# EAGLE design BeagleBone-MSP430Cape (EAGLE 6.4)
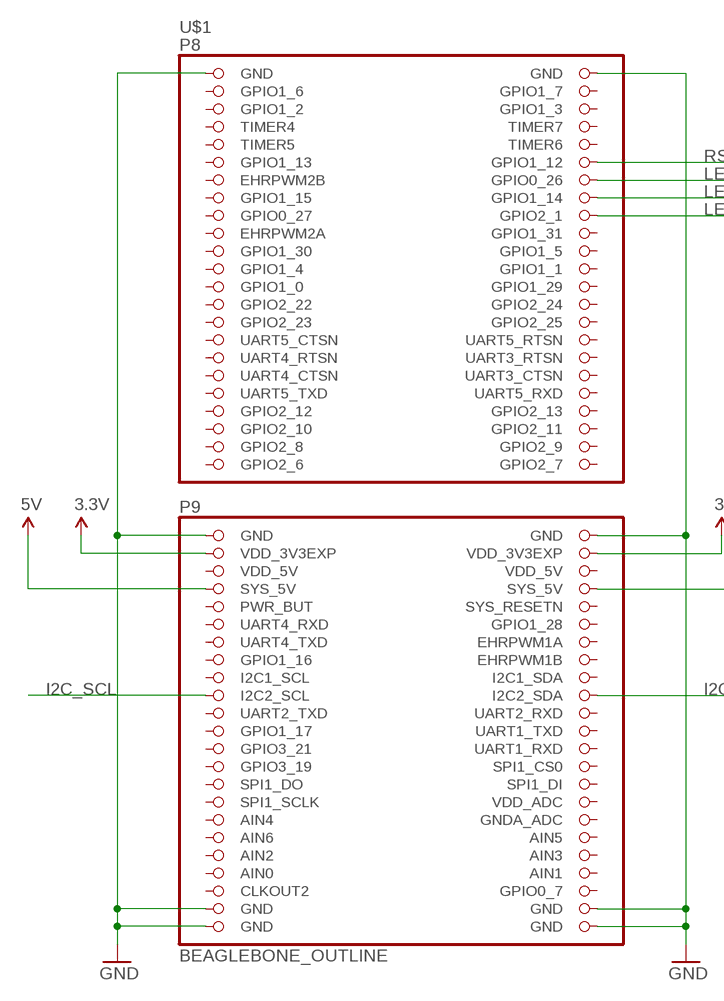
[diagram p0: schematic, sheet 1, part 1 of 2]
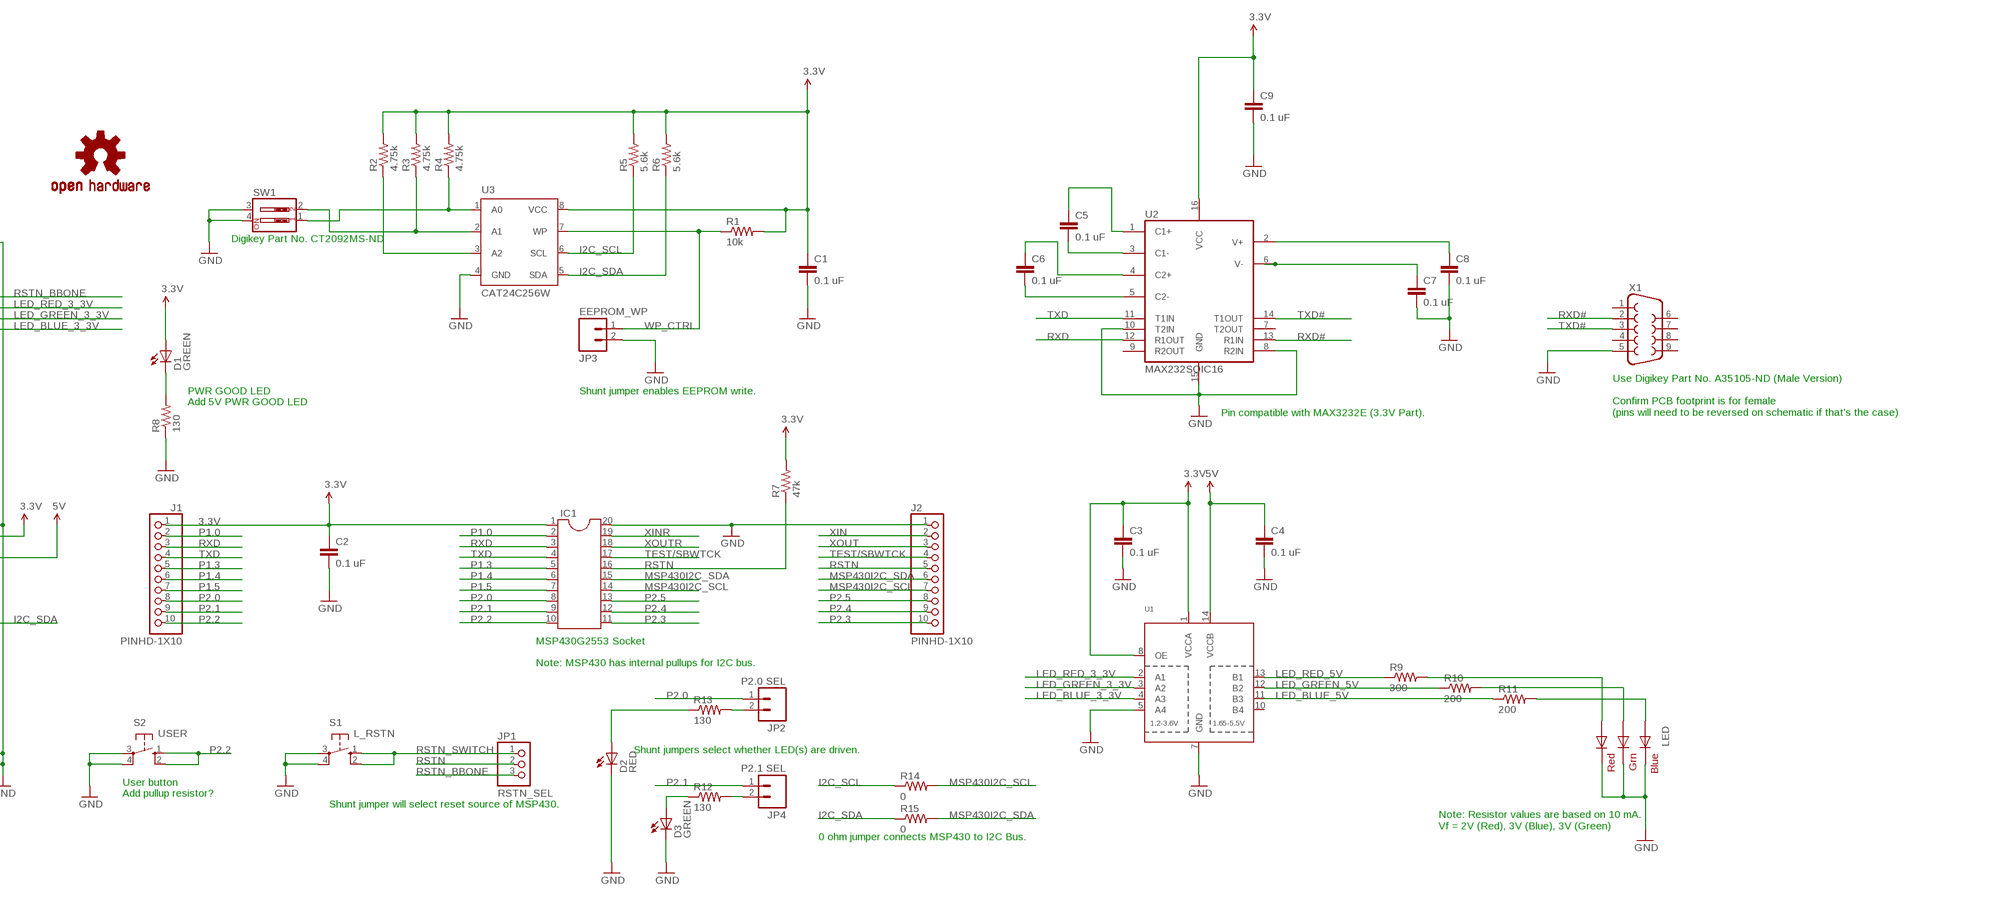
[diagram p1: schematic, sheet 1, part 2 of 2]

## Parts
C1  0.1 uF  CAP0805  [0805]
C2  0.1 uF  CAP0805  [0805]
C3  0.1 uF  CAP0805  [0805]
C4  0.1 uF  CAP0805  [0805]
C5  0.1 uF  CAP0805  [0805]
C6  0.1 uF  CAP0805  [0805]
C7  0.1 uF  CAP0805  [0805]
C8  0.1 uF  CAP0805  [0805]
C9  0.1 uF  CAP0805  [0805]
D1  GREEN  LED-GREEN0603  [LED-0603]
D2  RED  LED0603  [LED-0603]
D3  GREEN  LED0603  [LED-0603]
IC1  DIL20S  [SOCKET-20]
J1  PINHD-1X10  [1X10-BIG]
J2  PINHD-1X10  [1X10-BIG]
JP1  RSTN_SEL  PINHD-1X3  [1X03]
JP2  P2.0 SEL  M02PTH  [1X02]
JP3  EEPROM_WP  M02PTH  [1X02]
JP4  P2.1 SEL  M02PTH  [1X02]
LED  RGBLED5050  [RGBLED5050]
LOGO1  OSHW-LOGOL  [OSHW-LOGO-L]
R1  10k  RESISTOR0805-RES  [0805]
R2  4.75k  RESISTOR0805-RES  [0805]
R3  4.75k  RESISTOR0805-RES  [0805]
R4  4.75k  RESISTOR0805-RES  [0805]
R5  5.6k  RESISTOR0805-RES  [0805]
R6  5.6k  RESISTOR0805-RES  [0805]
R7  47k  RESISTOR0805-RES  [0805]
R8  130  RESISTOR0805-RES  [0805]
R9  300  RESISTOR0805-RES  [0805]
R10  200  RESISTOR0805-RES  [0805]
R11  200  RESISTOR0805-RES  [0805]
R12  130  RESISTOR0805-RES  [0805]
R13  130  RESISTOR0805-RES  [0805]
R14  0  RESISTOR0805-RES  [0805]
R15  0  RESISTOR0805-RES  [0805]
S1  L_RSTN  10-XX  [B3F-10XX]
S2  USER  10-XX  [B3F-10XX]
SW1  SW_DIP-2  [DIPSWITCH-02]
U1  TXB0104PWRSOIC14  [SO14]
U2  MAX232SOIC16  [SO016]
U3  CAT24C256W  [SO08]
U$1  BEAGLEBONE_OUTLINE  [BEAGLEBONE_SHIELD]
X1  DB9MALE  [DB9_MALE]

## Nets
3.3V: C1.1 C2.1 C3.1 C9.1 D1.A IC1.1 J1.1 R1.2 R2.2 R3.2 R4.2 R5.2 R6.2 R7.2 U1.1(VCCA) U1.8(OE) U2.16(VCC) U3.8(VCC) U$1.49(VDD_3V3EXP) U$1.50(VDD_3V3EXP)
5V: C4.1 U1.14(VCCB) U$1.53(SYS_5V) U$1.54(SYS_5V)
GND: C1.2 C2.2 C3.2 C4.2 C7.2 C8.2 C9.2 D2.C D3.C IC1.20 J2.1 JP3.2 LED.4(BLUE_C) LED.5(RED_C) LED.6(GREEN_C) R8.1 S1.3(P) S1.4(P1) S2.3(P) S2.4(P1) SW1.3 SW1.4 U1.5(A4) U1.7(GND) U2.8(R2IN) U2.10(T2IN) U2.15(GND) U3.4(GND) U$1.1(GND) U$1.2(GND) U$1.47(GND) U$1.48(GND) U$1.89(GND) U$1.90(GND) U$1.91(GND) U$1.92(GND) X1.5
I2C_SCL: R5.1 R14.1 U3.6(SCL) U$1.65(I2C2_SCL)
I2C_SDA: R6.1 R15.1 U3.5(SDA) U$1.66(I2C2_SDA)
LED_BLUE_3_3V: U1.4(A3) U$1.18(GPIO2_1)
LED_BLUE_5V: R11.1 U1.11(B3)
LED_GREEN_3_3V: U1.3(A2) U$1.16(GPIO1_14)
LED_GREEN_5V: R10.1 U1.12(B2)
LED_RED_3_3V: U1.2(A1) U$1.14(GPIO0_26)
LED_RED_5V: R9.1 U1.13(B1)
MSP430I2C_SCL: IC1.14 J2.7 R14.2
MSP430I2C_SDA: IC1.15 J2.6 R15.2
N$2: C5.2 U2.3(C1-)
N$3: C7.1 U2.6(V-)
N$4: R2.1 U3.3(A2)
N$5: R3.1 SW1.2 U3.2(A1)
N$6: R4.1 SW1.1 U3.1(A0)
N$7: D2.A R13.1
N$8: JP2.2 R13.2
N$10: JP4.2 R12.2
N$11: D3.A R12.1
N$19: D1.C R8.2
N$20: LED.2(RED_A) R9.2
N$21: LED.1(GREEN_A) R10.2
N$22: LED.3(BLUE_A) R11.2
N$23: C8.1 U2.2(V+)
N$24: C5.1 U2.1(C1+)
N$27: C6.1 U2.4(C2+)
N$28: C6.2 U2.5(C2-)
P1.0: IC1.2 J1.2
P1.3: IC1.5 J1.5
P1.4: IC1.6 J1.6
P1.5: IC1.7 J1.7
P2.0: IC1.8 J1.8 JP2.1
P2.1: IC1.9 J1.9 JP4.1
P2.2: IC1.10 J1.10 S2.1(S) S2.2(S1)
P2.3: IC1.11 J2.10
P2.4: IC1.12 J2.9
P2.5: IC1.13 J2.8
RSTN: IC1.16 J2.5 JP1.2 R7.1
RSTN_BBONE: JP1.3 U$1.12(GPIO1_12)
RSTN_SWITCH: JP1.1 S1.1(S) S1.2(S1)
RXD: IC1.3 J1.3 U2.12(R1OUT)
RXD#: U2.13(R1IN) X1.2
TEST/SBWTCK: IC1.17 J2.4
TXD: IC1.4 J1.4 U2.11(T1IN)
TXD#: U2.14(T1OUT) X1.3
WP_CTRL: JP3.1 R1.1 U3.7(WP)
XIN: J2.2
XINR: IC1.19
XOUT: J2.3
XOUTR: IC1.18
Unconnected: U1.10(B4) U2.7(T2OUT) U2.9(R2OUT) U$1.3(GPIO1_6) U$1.4(GPIO1_7) U$1.5(GPIO1_2) U$1.6(GPIO1_3) U$1.7(TIMER4) U$1.8(TIMER7) U$1.9(TIMER5) U$1.10(TIMER6) U$1.11(GPIO1_13) U$1.13(EHRPWM2B) U$1.15(GPIO1_15) U$1.17(GPIO0_27) U$1.19(EHRPWM2A) U$1.20(GPIO1_31) U$1.21(GPIO1_30) U$1.22(GPIO1_5) U$1.23(GPIO1_4) U$1.24(GPIO1_1) U$1.25(GPIO1_0) U$1.26(GPIO1_29) U$1.27(GPIO2_22) U$1.28(GPIO2_24) U$1.29(GPIO2_23) U$1.30(GPIO2_25) U$1.31(UART5_CTSN) U$1.32(UART5_RTSN) U$1.33(UART4_RTSN) U$1.34(UART3_RTSN) U$1.35(UART4_CTSN) U$1.36(UART3_CTSN) U$1.37(UART5_TXD) U$1.38(UART5_RXD) U$1.39(GPIO2_12) U$1.40(GPIO2_13) U$1.41(GPIO2_10) U$1.42(GPIO2_11) U$1.43(GPIO2_8) U$1.44(GPIO2_9) U$1.45(GPIO2_6) U$1.46(GPIO2_7) U$1.55(PWR_BUT) U$1.56(SYS_RESETN) U$1.57(UART4_RXD) U$1.58(GPIO1_28) U$1.59(UART4_TXD) U$1.60(EHRPWM1A) U$1.61(GPIO1_16) U$1.62(EHRPWM1B) U$1.63(I2C1_SCL) U$1.64(I2C1_SDA) U$1.67(UART2_TXD) U$1.68(UART2_RXD) U$1.69(GPIO1_17) U$1.70(UART1_TXD) U$1.71(GPIO3_21) U$1.72(UART1_RXD) U$1.73(GPIO3_19) U$1.74(SPI1_CS0) U$1.75(SPI1_DO) U$1.76(SPI1_DI) U$1.77(SPI1_SCLK) U$1.78(VDD_ADC) U$1.79(AIN4) U$1.80(GNDA_ADC) U$1.81(AIN6) U$1.82(AIN5) U$1.83(AIN2) U$1.84(AIN3) U$1.86(AIN1) U$1.87(CLKOUT2) U$1.88(GPIO0_7) X1.1 X1.4 X1.6 X1.7 X1.8 X1.9

## Notes on the sheet
- Digikey Part No. CT2092MS-ND
- PWR GOOD LED | Shunt jumper enables EEPROM write.
- Add 5V PWR GOOD LED
- Pin compatible with MAX3232E (3.3V Part).
- Use Digikey Part No. A35105-ND (Male Version)
  
  Confirm PCB footprint is for female
  (pins will need to be reversed on schematic if that's the case)
- MSP430G2553 Socket
- Note: MSP430 has internal pullups for I2C bus.
- Shunt jumpers select whether LED(s) are driven.
- User button
- Add pullup resistor?
- Shunt jumper will select reset source of MSP430.
- Note: Resistor values are based on 10 mA.
  Vf = 2V (Red), 3V (Blue), 3V (Green)
- 0 ohm jumper connects MSP430 to I2C Bus.

## Power pins joined to a net without a drawn wire
AIN0: U$1.85(AIN0)
VDD_5V: U$1.51(VDD_5V) U$1.52(VDD_5V)

## Library data of the parts
C1-C9 = SparkFun-Capacitors:CAP: Capacitor Standard 0603 ceramic capacitor, and 0.1" leaded capacitor.
D1 = SparkFun-LED:LED-GREEN: Various green LEDs 0603- DIO-00821 LARGE- DIO-00862 LILYPAD- DIO-09910; PROD_ID: DIO-00821
D2 D3 = SparkFun-LED:LED: LEDs Standard schematic elements and footprints for 5mm, 3mm, 1206, and 0603 sized LEDs. 5mm - Spark Fun Electronics SKU : COM-00529 (and others)
IC1 = ic-package:DIL20: Dual In Line / Socket
J1 J2 = adafruit:PINHD-1X10: Pin header 1x10 0.1" spacing With round pins
JP1 = adafruit:PINHD-1X3: PIN HEADER
JP2-JP4 = SparkFun-Connectors:M02: Header 2 Standard 2-pin 0.1" header. Use with straight break away headers (SKU : PRT-00116), right angle break away headers (PRT-00553), swiss pins (PRT-00743), machine pins (PRT-00117), and female headers (PRT-00115). Molex polarized connector foot print use with SKU : PRT-08233 with associated crimp pins and housings.
LED = adafruit:RGBLED: For 5050 RGB LEDs, the order of the LEDs may vary from one manufacturer to another!
LOGO1 = SparkFun-Aesthetics:OSHW-LOGO: Open Source Hardware Logo This logo indicates the piece of hardware it is found on incorporates a OSHW license and/or adheres to the definition of open source hardware found here: http://freedomdefined.org/OSHW
R1-R15 = SparkFun-Resistors:RESISTOR: Resistor Basic schematic elements and footprints for 0603, 1206, and PTH resistors.
S1 S2 = switch-omron:10-XX: OMRON SWITCH; MPN: B3F-1000; OC_FARNELL: 176432; OC_NEWARK: 36M3542
SW1 = SparkFun-Electromechanical:SW_DIP-2: DIP SWITCH
U1 = SparkFun-DigitalIC:TXB0104PWR: 4-Bit Bi-Directional Level Shifter 1.2V-3.6V (VCCA) to 1.65V-5.5V (VCCB) bi-directional level shifter with auto direction sensing. Max data rate - VCCA 1.8V: 20Mbps (50ns), VCCA 3.3V: 100Mbps (10ns) Digikey: 296-21929-1-ND (TSSOP) IC-11329; PROD_ID: IC-11329
U2 = SparkFun-DigitalIC:MAX232: RS232 Transceiver Very common IC. This is generically called 'MAX232', but works with the 3V equivalent MAX3232 generic ICs. Field tested and mother approved. Spark Fun Electronics SKU : COM-00316 (DIP) and COM-00589 (SMD)
U3 = vttay03_custom:CAT24C256W: 256 kb Serial CMOS EEPROM
U$1 = adafruit:BEAGLEBONE_OUTLINE: Should match A3 pinout - but not completely tested
X1 = SparkFun-Connectors:DB9: DB9 Connector Standard DB9 (D-Sub 9) serial connector. Can be used for CAN bus as well as RS485 and RS232. Footprint production proven. Spark Fun Electronics SKU : PRT-00429

## Board
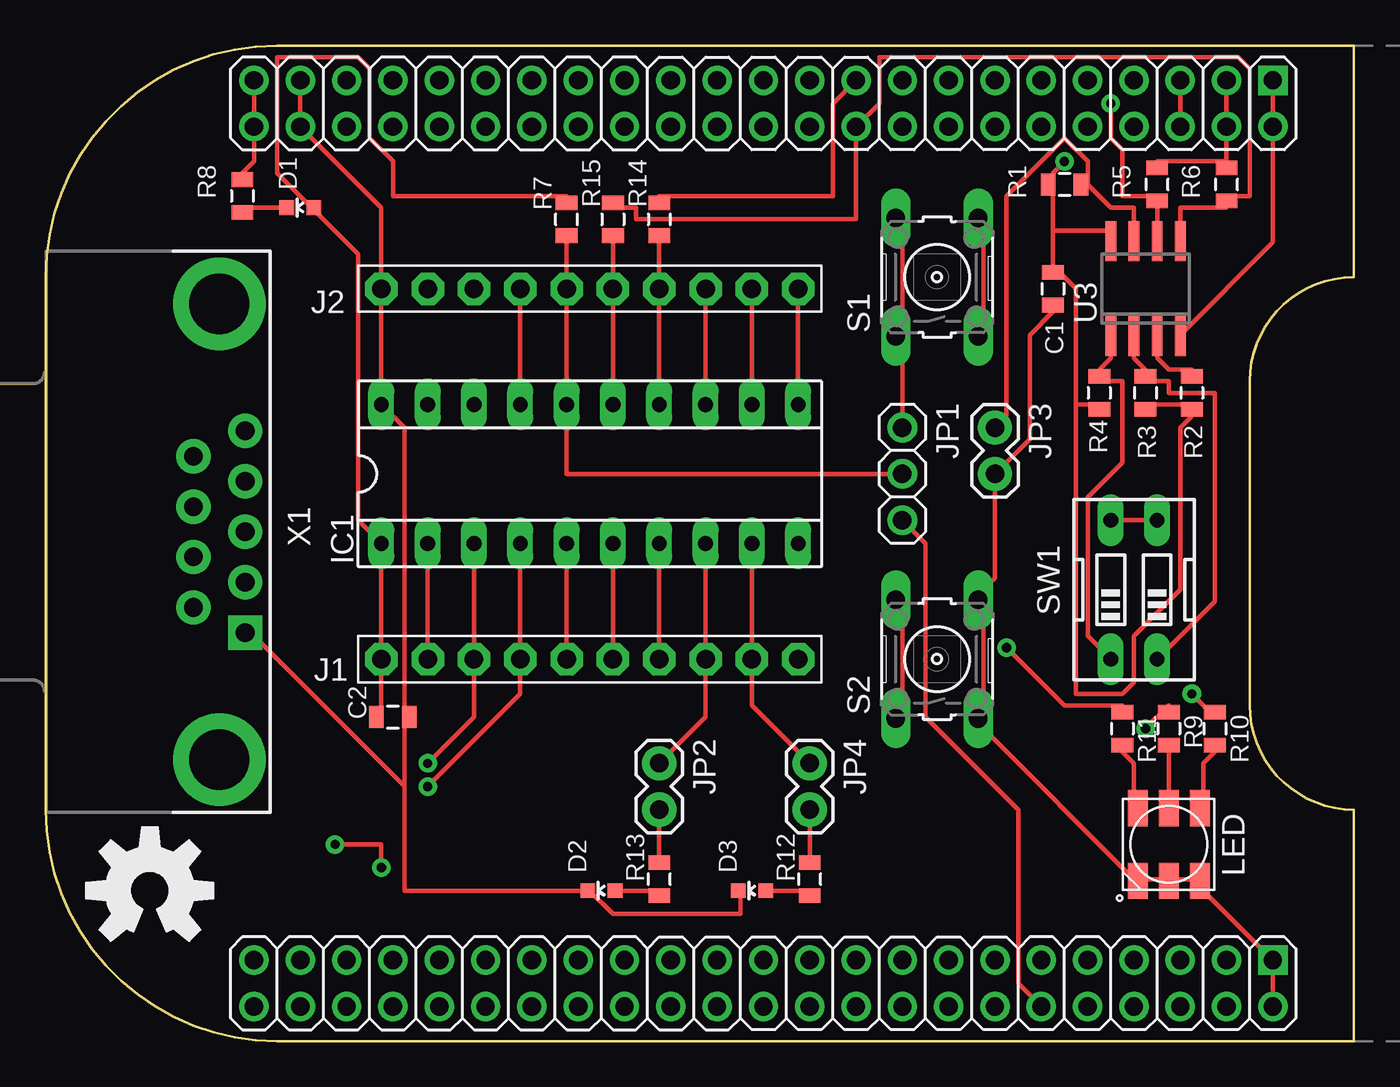
[diagram p2: board, top side]
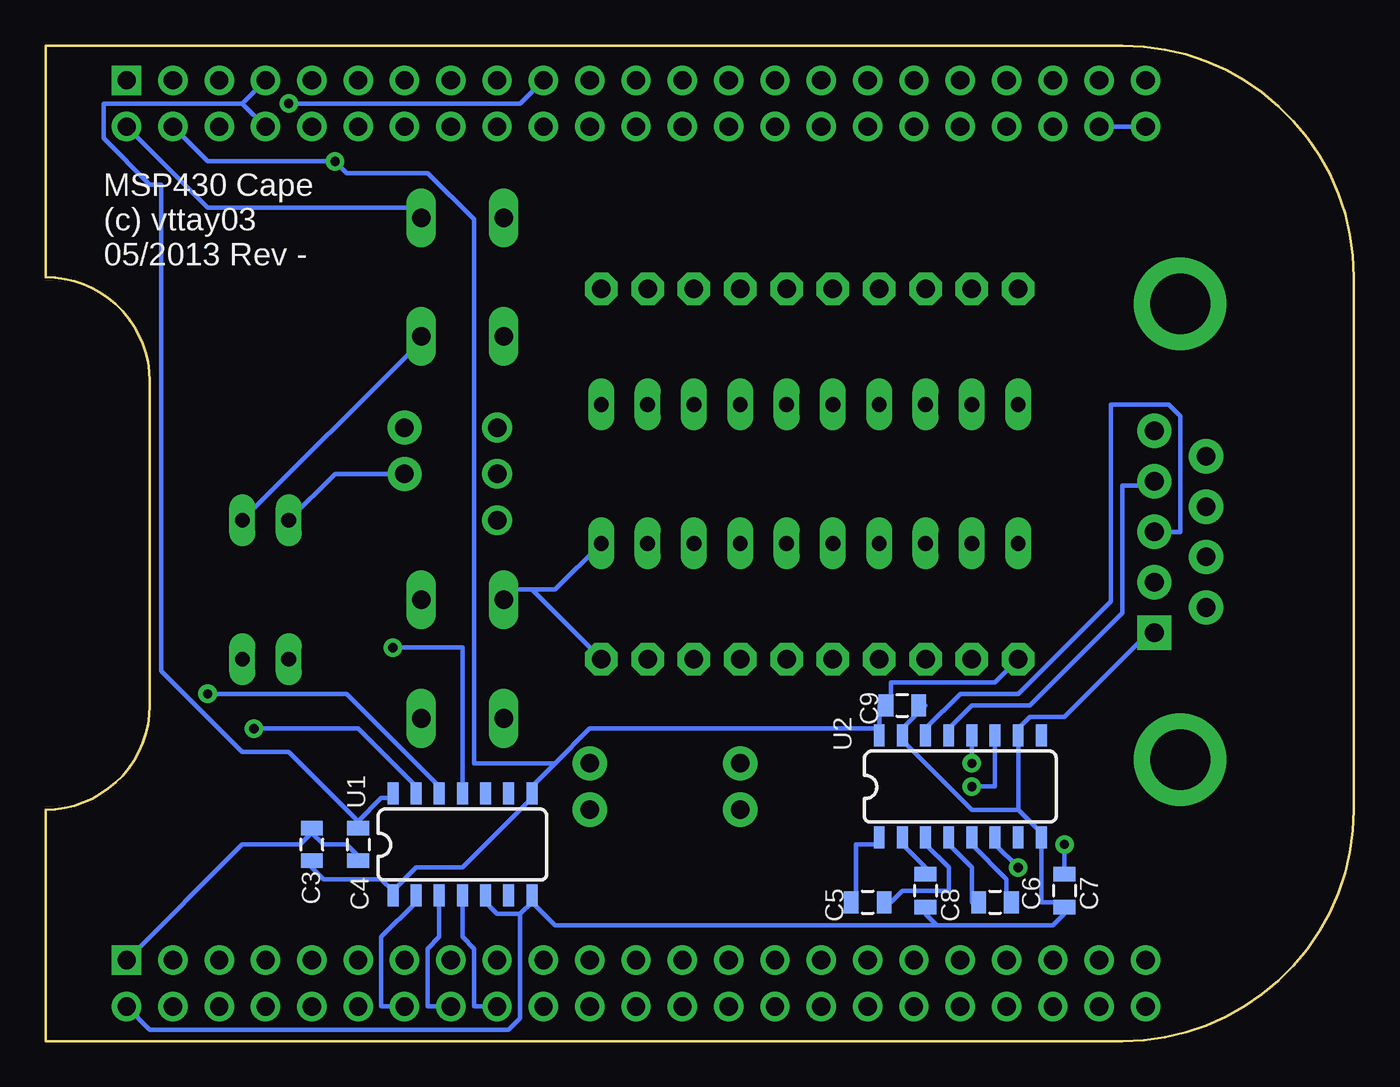
[diagram p3: board, bottom side, seen from below]

Size 71.75 x 54.61 mm. Coordinates in mm from the lower left corner, seen from the top.
Copper layers (1*16): Top 0.035mm / dielectric 1.5mm / Bottom 0.035mm
Design rules "SparkFun10mil": minimum track width 10mil, minimum drill 20mil, track to track 10mil, track to pad 10mil, pad to pad 10mil, via to via 10mil, smd to smd 10mil, copper to edge 10mil, drill to drill 8mil, minimum pad ring 12mil, minimum via ring 10mil, stop-mask expansion 4mil, vias tented up to drill 25mil, thermal gap 10mil

### Footprints (pad centres in the part's own frame; a part is rotated, then mirrored left to right if it is on the bottom)
0805 = smd 0.8 x 1.2: 1 -0.9,0; 2 0.9,0
LED-0603 = smd 0.8 x 0.8: A 0,-0.75; C 0,0.75
SOCKET-20 = drill 0.813 long: 1 -11.43,-3.81; 2 -8.89,-3.81; 3 -6.35,-3.81; 4 -3.81,-3.81; 5 -1.27,-3.81; 6 1.27,-3.81; 7 3.81,-3.81; 8 6.35,-3.81; 9 8.89,-3.81; 10 11.43,-3.81; 11 11.43,3.81; 12 8.89,3.81; 13 6.35,3.81; 14 3.81,3.81; 15 1.27,3.81; 16 -1.27,3.81; 17 -3.81,3.81; 18 -6.35,3.81; 19 -8.89,3.81; 20 -11.43,3.81
1X10-BIG = drill 1.016 pad 1.778 octagon: 1 -11.43,0; 2 -8.89,0; 3 -6.35,0; 4 -3.81,0; 5 -1.27,0; 6 1.27,0; 7 3.81,0; 8 6.35,0; 9 8.89,0; 10 11.43,0
1X03 = drill 1.016: 1 -2.54,0; 2 0,0; 3 2.54,0
1X02 = drill 1.016 pad 1.88: 1 0,0; 2 2.54,0
RGBLED5050 = smd 2 x 1.1: 1 -2,1.7; 2 -2,0; 3 -2,-1.7; 4 2,-1.7; 5 2,0; 6 2,1.7
B3F-10XX = drill 1.016 long: 1 -3.251,2.261; 2 3.251,2.261; 3 -3.251,-2.261; 4 3.251,-2.261
DIPSWITCH-02 = drill 0.813 long: 1 -1.27,-3.81; 2 1.27,-3.81; 3 1.27,3.81; 4 -1.27,3.81
SO14 = smd 0.6 x 1.2: 1 -3.81,-2.8; 2 -2.54,-2.8; 3 -1.27,-2.8; 4 0,-2.8; 5 1.27,-2.8; 6 2.54,-2.8; 7 3.81,-2.8; 8 3.81,2.8; 9 2.54,2.8; 10 1.27,2.8; 11 0,2.8; 12 -1.27,2.8; 13 -2.54,2.8; 14 -3.81,2.8
SO016 = smd 0.6 x 1.2: 1 -4.445,-2.8; 2 -3.175,-2.8; 3 -1.905,-2.8; 4 -0.635,-2.8; 5 0.635,-2.8; 6 1.905,-2.8; 7 3.175,-2.8; 8 4.445,-2.8; 9 4.445,2.8; 10 3.175,2.8; 11 1.905,2.8; 12 0.635,2.8; 13 -0.635,2.8; 14 -1.905,2.8; 15 -3.175,2.8; 16 -4.445,2.8
SO08 = smd 0.6 x 2.2: 1 -1.905,-2.6; 2 -0.635,-2.6; 3 0.635,-2.6; 4 1.905,-2.6; 5 1.905,2.6; 6 0.635,2.6; 7 -0.635,2.6; 8 -1.905,2.6
BEAGLEBONE_SHIELD = drill 1 square: 1 4.445,19.05; 47 52.705,19.05 | drill 1: 2 1.905,19.05; 3 4.445,21.59; 4 1.905,21.59; 5 4.445,24.13; 6 1.905,24.13; 7 4.445,26.67; 8 1.905,26.67; 9 4.445,29.21; 10 1.905,29.21; 11 4.445,31.75; 12 1.905,31.75; 13 4.445,34.29; 14 1.905,34.29; 15 4.445,36.83; 16 1.905,36.83; 17 4.445,39.37; 18 1.905,39.37; 19 4.445,41.91; 20 1.905,41.91; 21 4.445,44.45; 22 1.905,44.45; 23 4.445,46.99; 24 1.905,46.99; 25 4.445,49.53; 26 1.905,49.53; 27 4.445,52.07; 28 1.905,52.07; 29 4.445,54.61; 30 1.905,54.61; 31 4.445,57.15; 32 1.905,57.15; 33 4.445,59.69; 34 1.905,59.69; 35 4.445,62.23; 36 1.905,62.23; 37 4.445,64.77; 38 1.905,64.77; 39 4.445,67.31; 40 1.905,67.31; 41 4.445,69.85; 42 1.905,69.85; 43 4.445,72.39; 44 1.905,72.39; 45 4.445,74.93; 46 1.905,74.93; 48 50.165,19.05; 49 52.705,21.59; 50 50.165,21.59; 51 52.705,24.13; 52 50.165,24.13; 53 52.705,26.67; 54 50.165,26.67; 55 52.705,29.21; 56 50.165,29.21; 57 52.705,31.75; 58 50.165,31.75; 59 52.705,34.29; 60 50.165,34.29; 61 52.705,36.83; 62 50.165,36.83; 63 52.705,39.37; 64 50.165,39.37; 65 52.705,41.91; 66 50.165,41.91; 67 52.705,44.45; 68 50.165,44.45; 69 52.705,46.99; 70 50.165,46.99; 71 52.705,49.53; 72 50.165,49.53; 73 52.705,52.07; 74 50.165,52.07; 75 52.705,54.61; 76 50.165,54.61; 77 52.705,57.15; 78 50.165,57.15; 79 52.705,59.69; 80 50.165,59.69; 81 52.705,62.23; 82 50.165,62.23; 83 52.705,64.77; 84 50.165,64.77; 85 52.705,67.31; 86 50.165,67.31; 87 52.705,69.85; 88 50.165,69.85; 89 52.705,72.39; 90 50.165,72.39; 91 52.705,74.93; 92 50.165,74.93
DB9_MALE = drill 1.016 pad 1.88: 1 5.54,-1.42; 2 2.77,-1.42; 3 0,-1.42; 4 -2.77,-1.42; 6 4.15,1.42; 7 1.38,1.42; 8 -1.38,1.42; 9 -4.15,1.42 | drill 1.016 pad 1.88 square: 5 -5.54,-1.42 | drill 3.302 pad 5.08: G1 -12.5,0; G2 12.5,0

### Placement (x,y rotation side)
C1  55.24,41.27 270 top
C2  19.05,17.78 0 top
C3  57.15,10.79 90 bottom
C4  54.61,10.79 270 bottom
C5  26.67,7.62 0 bottom
C6  19.68,7.62 0 bottom
C7  15.88,8.26 270 bottom
C8  23.5,8.26 270 bottom
C9  24.77,18.41 0 bottom
D1  13.97,45.72 90 top
D2  30.48,8.26 90 top
D3  38.73,8.26 90 top
IC1  29.84,31.11 0 top
J1  29.84,20.95 0 top
J2  29.84,41.27 0 top
JP1  46.99,31.11 270 top
JP2  33.66,15.24 270 top
JP3  52.07,33.66 270 top
JP4  41.91,15.24 270 top
LED  61.59,10.79 270 top
LOGO1  5.71,8.26 0 top
R1  55.88,46.99 180 top
R2  62.87,35.56 270 top
R3  60.33,35.56 270 top
R4  57.78,35.56 270 top
R5  60.96,46.99 90 top
R6  64.77,46.99 90 top
R7  28.57,45.09 90 top
R8  10.79,46.35 270 top
R9  61.59,17.14 270 top
R10  64.14,17.14 270 top
R11  59.05,17.14 270 top
R12  41.91,8.89 90 top
R13  33.66,8.89 90 top
R14  33.66,45.09 270 top
R15  31.11,45.09 270 top
S1  48.9,41.91 90 top
S2  48.9,20.95 90 top
SW1  59.69,24.77 0 top
U1  48.9,10.79 0 bottom
U2  21.59,13.97 0 bottom
U3  60.33,41.27 0 top
U$1  86.36,0 90 top
X1  9.53,27.94 90 top

### Tracks (layer width: path | path; a pad name or v marks a point on that pad's centre or on a via)
3.3V  (via drill 0.51)
  Top 0.254: 64.77,48.26 60.96,48.26 R5.2 | 64.77,48.26 U$1.50 U$1.49 | 64.77,48.26 R6.2 | R3.2 60.33,34.92 62.87,34.92 R2.2 62.87,34.29 62.23,33.66 62.23,24.77 59.69,22.23 59.69,19.68 59.05,19.05 56.52,19.05 56.52,34.92 | 55.24,46.99 55.24,44.45 | 55.24,44.45 55.24,42.55 | 56.52,34.92 57.78,34.92 R4.2 | 56.52,34.92 56.52,41.27 55.24,42.55 | 55.24,42.55 C1.1 | 55.24,44.45 58.42,44.45 U3.8 | v55.88,48.26 55.24,47.62 55.24,46.99 | 55.24,46.99 R1.2 | C2.1 18.41,17.78 J1.1 IC1.1 17.14,28.57 17.14,43.18 14.61,45.72 | 14.61,45.72 12.7,47.62 12.7,53.98 17.14,53.98 17.78,53.34 17.78,49.53 19.05,48.26 19.05,46.35 28.57,46.35 R7.2 | 14.61,45.72 D1.A
  Bottom 0.254: U$1.50 62.87,48.26 v55.88,48.26 55.24,47.62 50.8,47.62 48.26,45.09 48.26,15.24 43.81,15.24 | 52.7,8.26 53.34,8.89 56.52,8.89 57.15,9.53 C3.1 | 52.7,8.26 51.44,9.53 48.9,9.53 45.09,13.34 U1.8 45.09,13.97 43.81,15.24 | 52.7,8.26 U1.1 | 26.04,17.14 26.04,18.41 C9.1 25.4,18.41 25.4,19.68 19.68,19.68 J1.1 | 43.81,15.24 41.91,17.14 26.04,17.14 | 26.04,17.14 U2.16
5V
  Bottom 0.254: 54.61,12.06 53.34,13.34 52.7,13.34 U1.14 | 54.61,12.06 58.42,15.88 60.96,15.88 65.41,20.32 65.41,46.99 66.04,46.99 68.58,49.53 68.58,51.44 60.96,51.44 | U$1.53 60.96,51.44 | 54.61,12.06 C4.1 | 60.96,51.44 U$1.54
GND
  Top 0.254: 61.59,8.89 60.33,8.89 LED.4 59.69,8.89 51.44,17.14 S2.3 51.44,17.78 51.44,24.13 S2.4 51.44,24.77 52.07,25.4 JP3.2 53.98,33.02 53.98,38.73 55.24,40.01 C1.2 | 61.59,8.89 62.87,8.89 LED.6 63.5,8.26 U$1.1 U$1.2 | 61.59,8.89 LED.5 | U3.4 62.23,38.73 67.31,43.81 U$1.48 U$1.47 | S1.3 51.44,38.73 51.44,45.09 S1.4 | SW1.3 SW1.4 | U$1.89 U$1.90 18.41,45.72 J2.1 IC1.20 19.68,33.66 19.68,17.78 | R8.1 10.79,47.62 11.43,48.26 U$1.92 U$1.91 | D3.C 38.1,8.26 38.1,6.99 31.11,6.99 29.84,8.26 D2.C 19.68,8.26 19.68,13.97 | 19.68,17.78 19.68,13.97 | 19.68,17.78 C2.2 | 19.68,13.97 11.43,22.23 X1.5
  Bottom 0.254: 57.15,11.43 56.52,10.79 55.24,10.79 54.61,10.16 C4.2 | 57.15,11.43 57.78,10.79 60.96,10.79 U$1.1 | 57.15,11.43 C3.2 | SW1.4 55.88,31.11 JP3.2 | SW1.3 51.44,38.1 S1.3 | U$1.48 62.87,45.72 51.44,45.72 S1.4 | 45.72,6.99 45.09,7.62 | 45.72,6.99 46.99,6.99 47.62,7.62 U1.5 | C9.2 23.5,18.41 24.77,17.14 U2.15 24.77,16.51 20.95,12.7 18.41,12.7 | 22.86,6.35 16.51,6.35 15.88,6.99 C7.2 15.88,7.62 17.14,7.62 U2.8 17.14,11.43 18.41,12.7 | 22.86,6.35 23.5,6.99 C8.2 | 18.41,12.7 U2.10 18.41,17.14 17.78,17.78 15.88,17.78 11.43,22.23 X1.5 | 45.09,7.62 43.81,6.35 22.86,6.35 | 45.09,7.62 U1.7 | U$1.92 U$1.90 | U$1.2 66.04,0.64 46.35,0.64 45.72,1.27 45.72,6.99
I2C_SCL  (via drill 0.51)
  Top 0.254: U3.6 R5.1 60.96,46.35 59.05,46.35 59.05,48.9 58.42,49.53 v58.42,51.44 | U$1.65 43.18,51.44 43.18,46.35 33.66,46.35 R14.1
  Bottom 0.254: v58.42,51.44 45.72,51.44 U$1.65
I2C_SDA
  Top 0.254: U3.5 62.23,45.72 64.77,45.72 R6.1 64.77,46.35 66.04,46.35 66.04,53.34 65.41,53.98 45.72,53.98 45.72,51.44 U$1.66 44.45,45.09 32.38,45.09 32.38,45.72 31.11,45.72 R15.1
LED_BLUE_3_3V
  Bottom 0.254: U1.4 48.9,5.71 48.26,5.08 48.26,1.91 U$1.18
LED_BLUE_5V  (via drill 0.51)
  Top 0.254: v52.7,21.59 55.88,18.41 59.05,18.41 R11.1
  Bottom 0.254: U1.11 48.9,21.59 v52.7,21.59
LED_GREEN_3_3V
  Bottom 0.254: U1.3 50.16,5.71 50.8,5.08 50.8,1.91 U$1.16
LED_GREEN_5V  (via drill 0.51)
  Top 0.254: v62.87,19.05 64.14,17.78 R10.1
  Bottom 0.254: v62.87,19.05 55.24,19.05 50.16,13.97 U1.12
LED_RED_3_3V
  Bottom 0.254: U$1.14 53.34,1.91 53.34,5.71 51.44,7.62 U1.2
LED_RED_5V  (via drill 0.51)
  Top 0.254: v60.33,17.14 61.59,18.41 R9.1
  Bottom 0.254: v60.33,17.14 54.61,17.14 51.44,13.97 U1.13
MSP430I2C_SCL
  Top 0.254: R14.2 J2.7 IC1.14
MSP430I2C_SDA
  Top 0.254: R15.2 J2.6 IC1.15
N$2
  Bottom 0.254: C5.2 25.4,7.62 24.77,8.26 22.23,8.26 22.23,9.53 23.5,10.79 U2.3
N$3  (via drill 0.51)
  Top 0.254: v15.88,10.79 18.41,10.79 v18.41,9.53
  Bottom 0.254: v15.88,10.79 C7.1 | v18.41,9.53 19.68,10.79 U2.6
N$4
  Top 0.254: U3.3 60.96,37.47 61.59,36.83 62.87,36.83 R2.1
N$5
  Top 0.254: U3.2 59.69,37.47 60.33,36.83 R3.1 60.33,36.2 61.59,36.2 61.59,35.56 64.14,35.56 64.14,24.13 SW1.2
N$6
  Top 0.254: U3.1 58.42,37.47 57.78,36.83 R4.1 57.78,36.2 59.05,36.2 59.05,31.75 57.15,29.84 57.15,22.23 SW1.1
N$7
  Top 0.254: 31.11,8.26 D2.A 33.66,8.26 R13.1
N$8
  Top 0.254: JP2.2 R13.2
N$10
  Top 0.254: JP4.2 R12.2
N$11
  Top 0.254: 39.37,8.26 D3.A 41.91,8.26 R12.1
N$19
  Top 0.254: 13.34,45.72 D1.C 10.79,45.72 R8.2
N$20
  Top 0.254: LED.2 R9.2
N$21
  Top 0.254: R10.2 64.14,15.88 63.5,15.24 63.5,13.34 LED.1
N$22
  Top 0.254: R11.2 59.05,15.88 59.69,15.24 59.69,13.34 LED.3
N$23
  Bottom 0.254: C8.1 23.5,9.53 24.77,10.79 U2.2
N$24
  Bottom 0.254: C5.1 27.3,7.62 27.3,10.79 26.04,10.79 U2.1
N$27
  Bottom 0.254: C6.1 20.95,7.62 20.95,9.53 22.23,10.79 U2.4
N$28
  Bottom 0.254: C6.2 19.05,7.62 19.05,8.89 20.95,10.79 U2.5
P1.0
  Top 0.254: J1.2 IC1.2
P1.3
  Top 0.254: J1.5 IC1.5
P1.4
  Top 0.254: J1.6 IC1.6
P1.5
  Top 0.254: J1.7 IC1.7
P2.0
  Top 0.254: IC1.8 J1.8 36.2,17.78 JP2.1
P2.1
  Top 0.254: IC1.9 J1.9 38.73,18.41 JP4.1
P2.2
  Top 0.254: S2.1 46.99,17.78 46.99,24.13 S2.2
  Bottom 0.254: IC1.10 43.81,24.77 45.09,24.77 | 45.09,24.77 46.35,24.77 S2.2 | 45.09,24.77 J1.10
P2.3
  Top 0.254: J2.10 IC1.11
P2.4
  Top 0.254: J2.9 IC1.12
P2.5
  Top 0.254: J2.8 IC1.13
RSTN
  Top 0.254: R7.1 J2.5 IC1.16 28.57,31.11 JP1.2
RSTN_BBONE
  Top 0.254: U$1.12 53.34,3.17 53.34,12.7 48.26,17.78 48.26,27.3 JP1.3
RSTN_SWITCH
  Top 0.254: JP1.1 46.99,38.1 S1.1 46.99,38.73 46.99,45.09 S1.2
RXD  (via drill 0.51)
  Top 0.254: v20.95,15.24 23.5,17.78 J1.3 IC1.3
  Bottom 0.254: v20.95,15.24 U2.12
RXD#
  Bottom 0.254: U2.13 22.23,17.14 20.95,18.41 17.78,18.41 12.7,23.5 12.7,30.48 11.43,30.48 X1.2
TEST/SBWTCK
  Top 0.254: J2.4 IC1.17
TXD  (via drill 0.51)
  Top 0.254: v20.95,13.97 26.04,19.05 J1.4 IC1.4
  Bottom 0.254: U2.11 19.68,13.97 v20.95,13.97
TXD#
  Bottom 0.254: X1.3 9.53,27.94 9.53,34.29 10.16,34.92 13.34,34.92 13.34,24.13 18.41,19.05 21.59,19.05 23.5,17.14 U2.14
VDD_5V
  Top 0.254: U$1.51 U$1.52
WP_CTRL
  Top 0.254: 57.15,46.99 58.42,45.72 59.69,45.72 U3.7 | 57.15,46.99 57.15,48.26 55.88,49.53 52.7,46.35 52.7,34.29 JP3.1 | 57.15,46.99 R1.1

### Text on the board
bNames: MSP430 Cape / (c) vttay03 / 05/2013 Rev -